# Altium schematic sheet VUE_PIC32_v1_0_Speed_Sensor.SchDoc: [VUE32 - Speed Sensor]
size A4; Engineer: JFDuval; Revision: 1.0
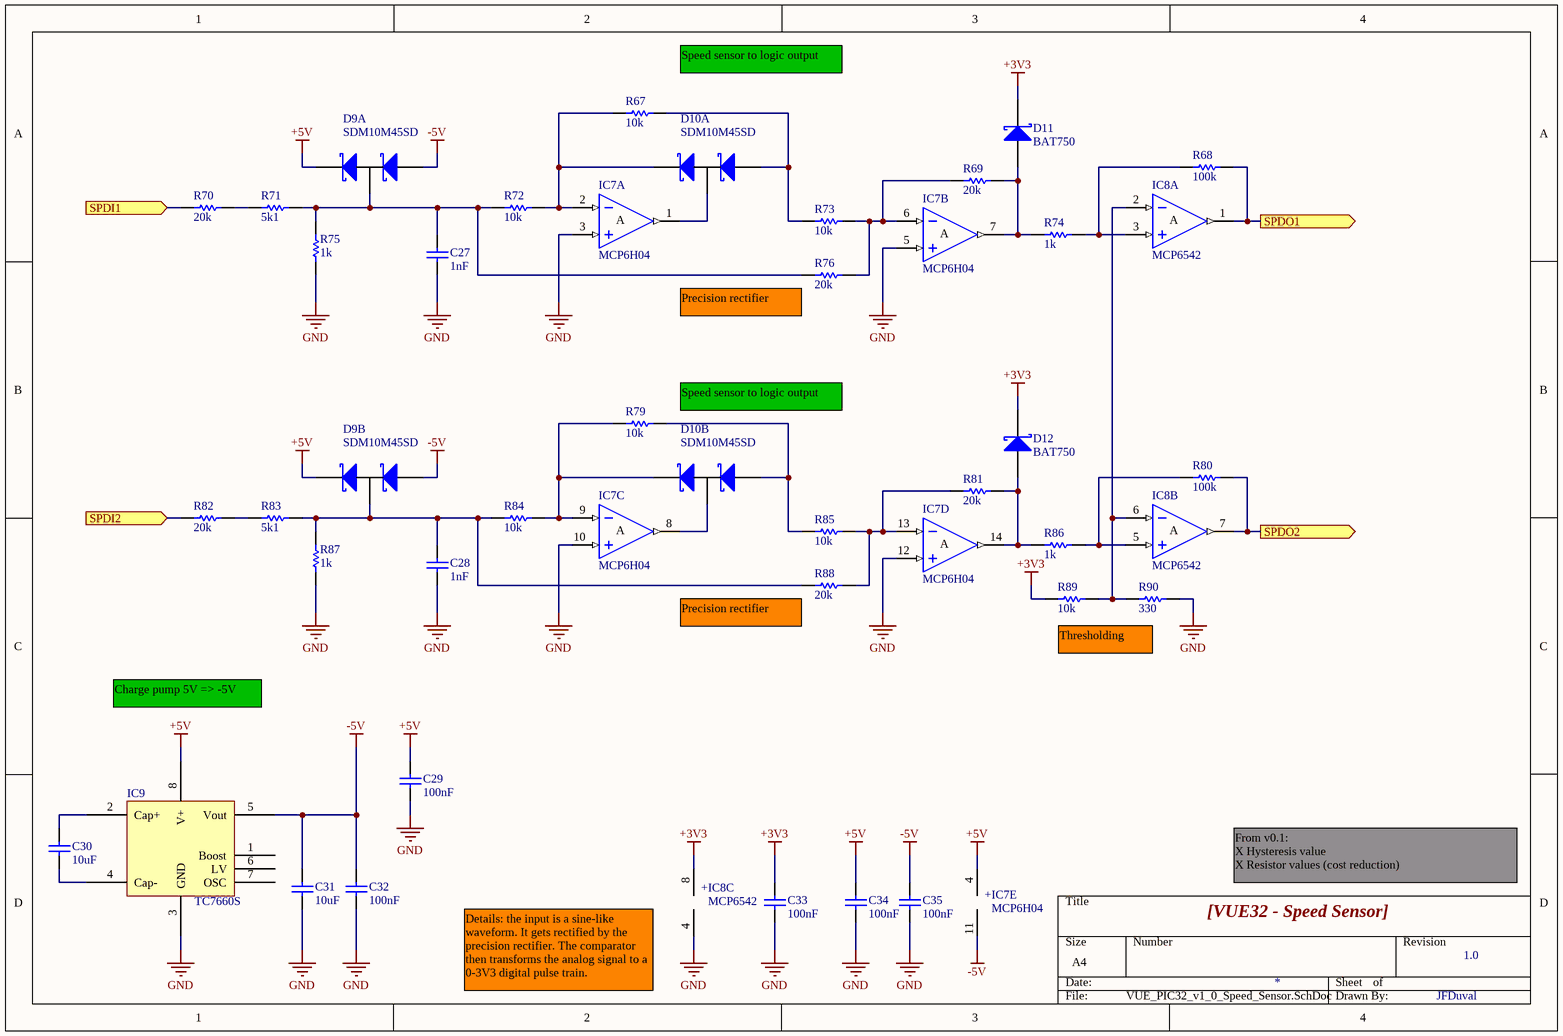
[diagram p0: VUE_PIC32_v1_0_Speed_Sensor.SchDoc]

## Parts
C27  1nF  [0402C]
C28  1nF  [0402C]
C29  100nF  [0402C]
C30  10uF  [0805C]
C31  10uF  [0805C]
C32  100nF  [0402C]
C33  100nF  [0402C]
C34  100nF  [0402C]
C35  100nF  [0402C]
D9  SDM10M45SD  [SOT23-6]  (parts A,B of 2)
D10  SDM10M45SD  [SOT23-6]  (parts A,B of 2)
D11  BAT750  [SOT23-3]
D12  BAT750  [SOT23-3]
IC7  MCP6H04  [TSSOP14]  (parts A,B,C,D,E of 5)
IC8  MCP6542  [MSOP-8]  (parts A,B,C of 3)
IC9  TC7660S  [SOIC-8]
R67  10k  [0402]
R68  100k  [0402]
R69  20k  [0402]
R70  20k  [0402]
R71  5k1  [0402]
R72  10k  [0402]
R73  10k  [0402]
R74  1k  [0402]
R75  1k  [0402]
R76  20k  [0402]
R79  10k  [0402]
R80  100k  [0402]
R81  20k  [0402]
R82  20k  [0402]
R83  5k1  [0402]
R84  10k  [0402]
R85  10k  [0402]
R86  1k  [0402]
R87  1k  [0402]
R88  20k  [0402]
R89  10k  [0402]
R90  330  [0402]

## Ports
SPDI1 (in), SPDI2 (in), SPDO1 (out), SPDO2 (out)

## Nets
+3V3: C33.2 D11.3(K) D12.3(K) IC8.8(VDD) R89.1
+5V: C29.2 C34.2 D9.2(K) D9.5(K) IC7.4(VDD) IC9.8(V+)
-5V: C31.2 C32.2 C35.2 D9.1(A) D9.4(A) IC7.11(VSS) IC9.5(Vout)
GND: C27.1 C28.1 C29.1 C31.1 C32.1 C33.1 C34.1 C35.1 IC7.3(IN+) IC7.5(IN+) IC7.10(IN+) IC7.12(IN+) IC8.4(VSS) IC9.3(GND) R75.1 R87.1 R90.2
SPDI1: R70.1 ; port SPDI1
SPDI2: R82.1 ; port SPDI2
SPDO1: IC8.1(OUT) R68.2 ; port SPDO1
SPDO2: IC8.7(OUT) R80.2 ; port SPDO2
NetC27_2: C27.2 D9.6(M) R71.1 R72.1 R75.2 R76.1
NetC28_2: C28.2 D9.3(M) R83.1 R84.1 R87.2 R88.1
NetC30_1: C30.1 IC9.4(Cap-)
NetC30_2: C30.2 IC9.2(Cap+)
NetD10_1: D10.1(A) R67.2 R73.1
NetD10_2: D10.2(K) IC7.2(IN-) R67.1 R72.2
NetD10_3: D10.3(M) IC7.8(OUT)
NetD10_4: D10.4(A) R79.2 R85.1
NetD10_5: D10.5(K) IC7.9(IN-) R79.1 R84.2
NetD10_6: D10.6(M) IC7.1(OUT)
NetD11_1: D11.1(A) IC7.7(OUT) R69.2 R74.2
NetD12_1: D12.1(A) IC7.14(OUT) R81.2 R86.2
NetIC7_6: IC7.6(IN-) R69.1 R73.2 R76.2
NetIC7_13: IC7.13(IN-) R81.1 R85.2 R88.2
NetIC8_2: IC8.2(IN-) IC8.6(IN-) R89.2 R90.1
NetIC8_3: IC8.3(IN+) R68.1 R74.1
NetIC8_5: IC8.5(IN+) R80.1 R86.1
NetR70_2: R70.2 R71.2
NetR82_2: R82.2 R83.2

Not connected (* = marked no-connect by the designer): IC9 1(Boost) 6(LV) 7(OSC)

## Notes on the sheet
- (near R67) Speed sensor to logic output
- (near R76) Precision rectifier
- (near R79) Speed sensor to logic output
- (near R88) Precision rectifier
- Thresholding
- Charge pump 5V => -5V
- From v0.1:
  X Hysteresis value
  X Resistor values (cost reduction)
- (near IC8) Details: the input is a sine-like waveform. It gets rectified by the precision rectifier. The comparator then transforms the analog signal to a 0-3V3 digital pulse train.
- (in symbol IC_COMP_MICROCHIP_MCP6542_DUAL_MSOP8, part A) A
- (in symbol IC_COMP_MICROCHIP_MCP6542_DUAL_MSOP8, part B) A
- (in symbol IC_COMP_MICROCHIP_MCP6542_DUAL_MSOP8, part C) +
- (in symbol IC_OPA_MICROCHIP_MCP6H04_QUAD_TSSOP14, part A) A
- (in symbol IC_OPA_MICROCHIP_MCP6H04_QUAD_TSSOP14, part B) A
- (in symbol IC_OPA_MICROCHIP_MCP6H04_QUAD_TSSOP14, part C) A
- (in symbol IC_OPA_MICROCHIP_MCP6H04_QUAD_TSSOP14, part D) A
- (in symbol IC_OPA_MICROCHIP_MCP6H04_QUAD_TSSOP14, part E) +

## Library data of the parts
C27 C28 = CAP_TDK_C_0402_1nF_25V: CAP CER 1000PF 25V 10% X7R 0402; MfgPartNumber: C1005X7R1E102K; Mfg: TDK; Digikey: 445-4924-1-ND; Value: 1nF
C29 C32-C35 = CAP_TDK_C_0402_100nF_25V: CAP CER 0.1UF 25V Y5V 0402; MfgPartNumber: C1005Y5V1E104Z; Mfg: TDK; Digikey: 445-3445-1-ND; Value: 100nF
C30 C31 = CAP_MURATA_C_0805_10uF_16V: CAP CER 10UF 16V Y5V 0805; MfgPartNumber: GRM21BF51C106ZE15L; Mfg: Murata; Digikey: 490-3347-1-ND; Value: 10uF
D9 D10 = DIODE_DIODESINC_SDM10M45SD_QUAD_SCHOTTKY_45V_200MA: DIODE SCHOTTKY ARRAY 45V SOT26; MfgPartNumber: SDM10M45SD-7-F; Mfg: Diodes Inc; Digikey: SDM10M45SD-FDICT-ND; Value: SDM10M45SD
D11 D12 = DIODE_DIODESINC_BAT750_SCHOTTKY_SOT23_40V_750MA: DIODE SCHOTTKY 40V 750MA SOT23-3; MfgPartNumber: BAT750TA; Mfg: Diodes/Zetex; Digikey: BAT750CT-ND; Value: BAT750
IC7 = IC_OPA_MICROCHIP_MCP6H04_QUAD_TSSOP14: IC OPAMP QUAD16V 1.2MHZ 14TSSOP; MfgPartNumber: MCP6H04-E/ST; Mfg: Microchip Technology; Value: MCP6H04; Digikey: MCP6H04-E/ST-ND
IC8 = IC_COMP_MICROCHIP_MCP6542_DUAL_MSOP8: IC COMP 1.6V DUAL P-P 8SOIC; MfgPartNumber: MCP6542-E/MS; Mfg: Microchip Technology; Value: MCP6542; Digikey: MCP6542-E/MS-ND
IC9 = IC_MICROCHIP_TC7660S_VOLT_INV_DBL_8SOIC: IC CHRG PUMP INV ADJ 20MA 8SOIC; MfgPartNumber: TC7660SEOA713; Mfg: Microchip Technology; Value: TC7660S; Digikey: TC7660SEOA713CT-ND
R67 R72 R73 R79 R84 R85 R89 = RES_YAGEO_0402_10K_1PCT: RES 10.0K OHM 1/16W 1% 0402 SMD; MfgPartNumber: RC0402FR-0710KL; Mfg: Yageo; Digikey: 311-10.0KLRCT-ND; Value: 10k
R68 R80 = RES_YAGEO_0402_100K_1PCT: RES 100K OHM 1/16W 1% 0402 SMD; MfgPartNumber: RC0402FR-07100KL; Mfg: Yageo; Digikey: 311-100KLRCT-ND; Value: 100k
R69 R70 R76 R81 R82 R88 = RES_YAGEO_0402_20K_1PCT: RES 20.0K OHM 1/16W 1% 0402 SMD; MfgPartNumber: RC0402FR-0720KL; Mfg: Yageo; Digikey: 311-20.0KLRCT-ND; Value: 20k
R71 R83 = RES_YAGEO_0402_5K1_1PCT: RES 5.10K OHM 1/16W 1% 0402 SMD; MfgPartNumber: RC0402FR-075K1L; Mfg: Yageo; Digikey: 311-5.10KLRCT-ND; Value: 5k1
R74 R75 R86 R87 = RES_YAGEO_0402_1K_1PCT: RES 1.00K OHM 1/16W 1% 0402 SMD; MfgPartNumber: RC0402FR-071KL; Mfg: Yageo; Digikey: 311-1.00KLRCT-ND; Value: 1k
R90 = RES_YAGEO_0402_330_1PCT: RES 330 OHM 1/16W 1% 0402 SMD; MfgPartNumber: RC0402FR-07330RL; Mfg: Yageo; Digikey: 311-330LRCT-ND; Value: 330